# EAGLE design RM_htr (EAGLE 9.6.2)
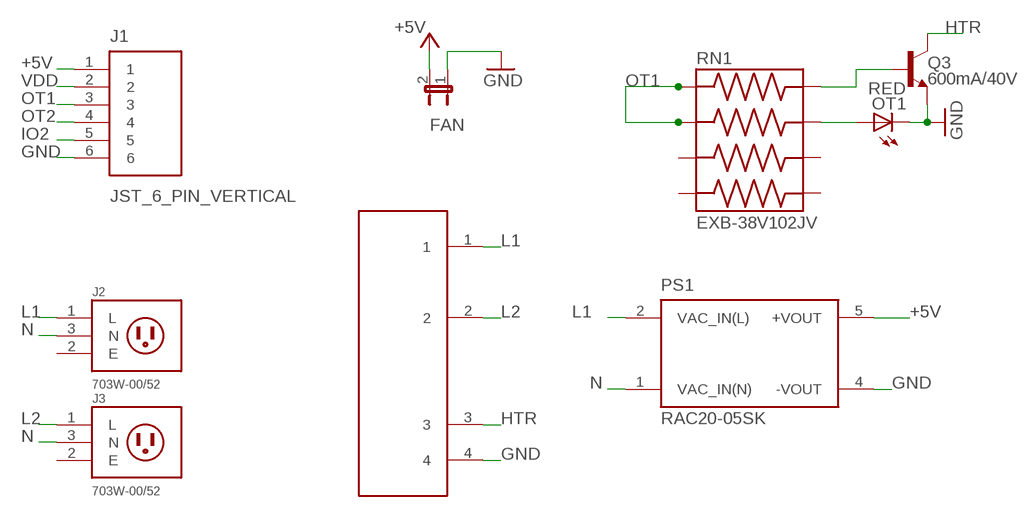
[diagram p0: schematic, sheet 1]

## Parts
FAN  JP1E  [JP1]
J1  JST_6_PIN_VERTICAL  [JST-6-SMD-VERT-1.0MM]
J2  703W-00/52  [QUALTEK_703W-00/52]
J3  703W-00/52  [QUALTEK_703W-00/52]
OT1  RED  LEDCHIPLED_0805  [CHIPLED_0805]
PS1  RAC20-05SK  [CONV_RAC20-05SK]
Q3  600mA/40V  TRANS_NPN-MMBT2222AL  [SOT23-3]
RN1  EXB-38V102JV  [RESCAXS80P320X160X60-8N]
U$1  PF240D25X  [PF240D25X]

## Nets
+5V: FAN.2 J1.1 PS1.5(+VOUT)
GND: FAN.1 J1.6 OT1.C PS1.4(-VOUT) Q3.2(E) U$1.4
HTR: Q3.3(C) U$1.3
IO2: J1.5
L1 [AC]: J2.1(L) PS1.2(VAC_IN(L)) U$1.1
L2 [AC]: J3.1(L) U$1.2
N [AC]: J2.3(N) J3.3(N) PS1.1(VAC_IN(N))
N$5: Q3.1(B) RN1.8
N$6: OT1.A RN1.7
OT1: J1.3 RN1.1 RN1.2
OT2: J1.4
VDD: J1.2
Unconnected: RN1.3 RN1.4 RN1.5 RN1.6

## Power pins joined to a net without a drawn wire
E: J2.2(E) J3.2(E)

## Library data of the parts
FAN = jumper:JP1E: JUMPER
J1 = SparkFun-Connectors:JST_6_PIN_VERTICAL: JST 6 pin vertical connector Here is a six pin vertical 1.0mm pitch connector. It is useful if you need something very tiny as a connection. These are not the standard JST type connectors we use on most of our boards, but are actually the much smaller JST-SH type. Here is the connector we sell at SparkFun: JST SH Vertical 6-Pin Connector - SMD <https://www.sparkfun.com/products/579> (GPS-00579) Datasheet <http://www.sparkfun.com/datasheets/GPS/EM406-SMDConnector-eSH.pdf> It was used on these SparkFun products: SparkFun GPS Breakout <https://www.sparkfun.com/products/11818> (BOB-11818) SparkFun Weather Shield <https://www.sparkfun.com/products/12081> (DEV-12081) And many, many other GPS related products.; PROD_ID: CONN-08249; SF_ID: GPS-00579
J2 J3 = 703W-00_52:703W-00/52: 3 Position 250 V 10 A Male Pins AC Receptacle Right Angle Connector; DESCRIPTION: Power Entry Connector Receptacle, Male Blades IEC 320-C14 Panel Mount, Flange; Through Hole, Right Angle; DIGI-KEY_PART_NUMBER: Q218-ND; MF: Qualtek; MP: 703W-00/52; PACKAGE: None
OT1 = adafruit:LED: LED OSRAM: - CHIPLED LG R971, LG N971, LY N971, LG Q971, LY Q971, LO R971, LY R971 LH N974, LH R974 LS Q976, LO Q976, LY Q976 LO Q996 - Hyper CHIPLED LW Q18S LB Q993, LB Q99A, LB R99A - SideLED LS A670, LO A670, LY A670, LG A670, LP A670 LB A673, LV A673, LT A673, LW A673 LH A674 LY A675 LS A676, LA A676, LO A676, LY A676, LW A676 LS A679, LY A679, LG A679 - Hyper Micro SIDELED® LS Y876, LA Y876, LO Y876, LY Y876 LT Y87S - SmartLED LW L88C, LW L88S LB L89C, LB L89S, LG L890 LS L89K, LO L89K, LY L89K LS L896, LA L896, LO L896, LY L896 - TOPLED LS T670, LO T670, LY T670, LG T670, LP T670 LSG T670, LSP T670, LSY T670, LOP T670, LYG T670 LG T671, LOG T671, LSG T671 LB T673, LV T673, LT T673, LW T673 LH T674 LS T676, LA T676, LO T676, LY T676, LB T676, LH T676, LSB T676, LW T676 LB T67C, LV T67C, LT T67C, LS T67K, LO T67K, LY T67K, LW E67C LS E67B, LA E67B, LO E67B, LY E67B, LB E67C, LV E67C, LT E67C LW T67C LS T679, LY T679, LG T679 LS T770, LO T770, LY T770, LG T770, LP T770 LB T773, LV T773, LT T773, LW T773 LH T774 LS E675, LA E675, LY E675, LS T675 LS T776, LA T776, LO T776, LY T776, LB T776 LHGB T686 LT T68C, LB T68C - Hyper Mini TOPLED® LB M676 - Mini TOPLED Santana® LG M470 LS M47K, LO M47K, LY M47K Source: http://www.osram.convergy.de/
PS1 = RAC20-05SK:RAC20-05SK: AC/DC CONVERTER 5V 20W; DESCRIPTION: 20W AC/DC-Converter 'POWERLINE' 2x1 3kV reg; DIGI-KEY_PART_NUMBER: 945-3184-ND; MF: Recom Power; MP: RAC20-05SK; PACKAGE: DIP-5 Recom Power; PURCHASE-URL: https://pricing.snapeda.com/search/part/RAC20-05SK/?ref=eda
Q3 = SparkFun-DiscreteSemi:TRANS_NPN: NPN transistor Current controlled devices typically used to amplify current or used as a switch. BC547 - COM-08928 <http://www.sparkfun.com/products/8928> (TO-92 45V 100mA) (1.Collector 2.Base 3.Emitter) 2N3904 - COM-00521 <http://www.sparkfun.com/products/521> (TO-92 40V 200mA) (1.Emitter 2.Base 3.Collector) P2N2222A - COM-12852 <http://www.sparkfun.com/products/12852> (TO-92 40V 600mA) (1.Collector 2.Base 3.Emitter); PROD_ID: TRANS-08049
RN1 = EXB-38V102JV:EXB-38V102JV: Res Thick Film Array 470 Ohm 5% ?200ppm/C ISOL Molded 8-Pin 1206(4 X 0603) Convex SMD Automotive T/R; DESCRIPTION: 1k Ohm ±5% 62.5mW Power Per Element Isolated Resistor Network/Array ±200ppm/°C 1206 (3216 Metric), Convex, Long Side Terminals; DIGI-KEY_PART_NUMBER: Y9102CT-ND; MF: Panasonic; MP: EXB-38V102JV; PACKAGE: 1206 Panasonic; PURCHASE-URL: https://pricing.snapeda.com/search/part/EXB-38V102JV/?ref=eda
U$1 = SSR:PF240D25X

## Net classes
0 default: width 0.305 mm, drill 0.127 mm, clearance 0.102 mm
1 DC: width 0.305 mm, drill 0.254 mm, clearance 0.102 mm to class 0, clearance 0.102 mm
2 AC: width 6.096 mm, drill 0.305 mm, clearance 0.406 mm to class 0, clearance 0.406 mm to class 1, clearance 0.406 mm
3 Hole: drill 2.05 mm, clearance 2.54 mm to class 0, clearance 2.54 mm to class 1, clearance 2.54 mm to class 2, clearance 5.08 mm

## Board
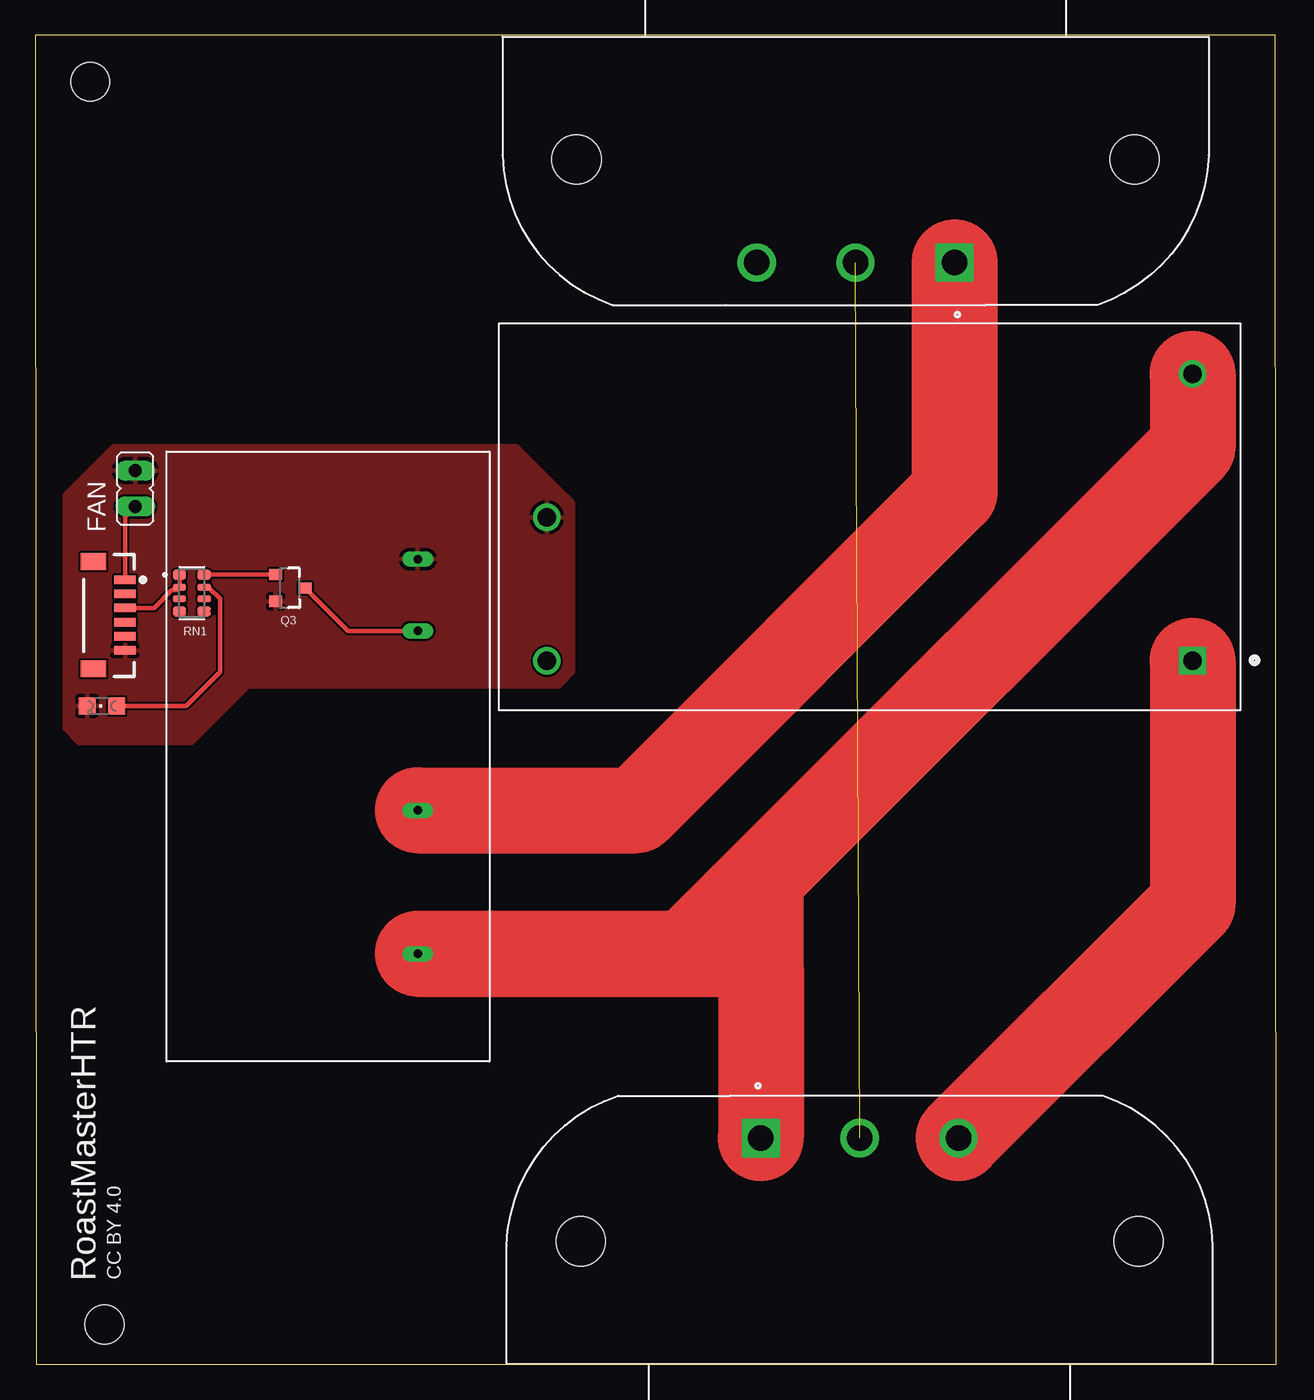
[diagram p1: board, top side]
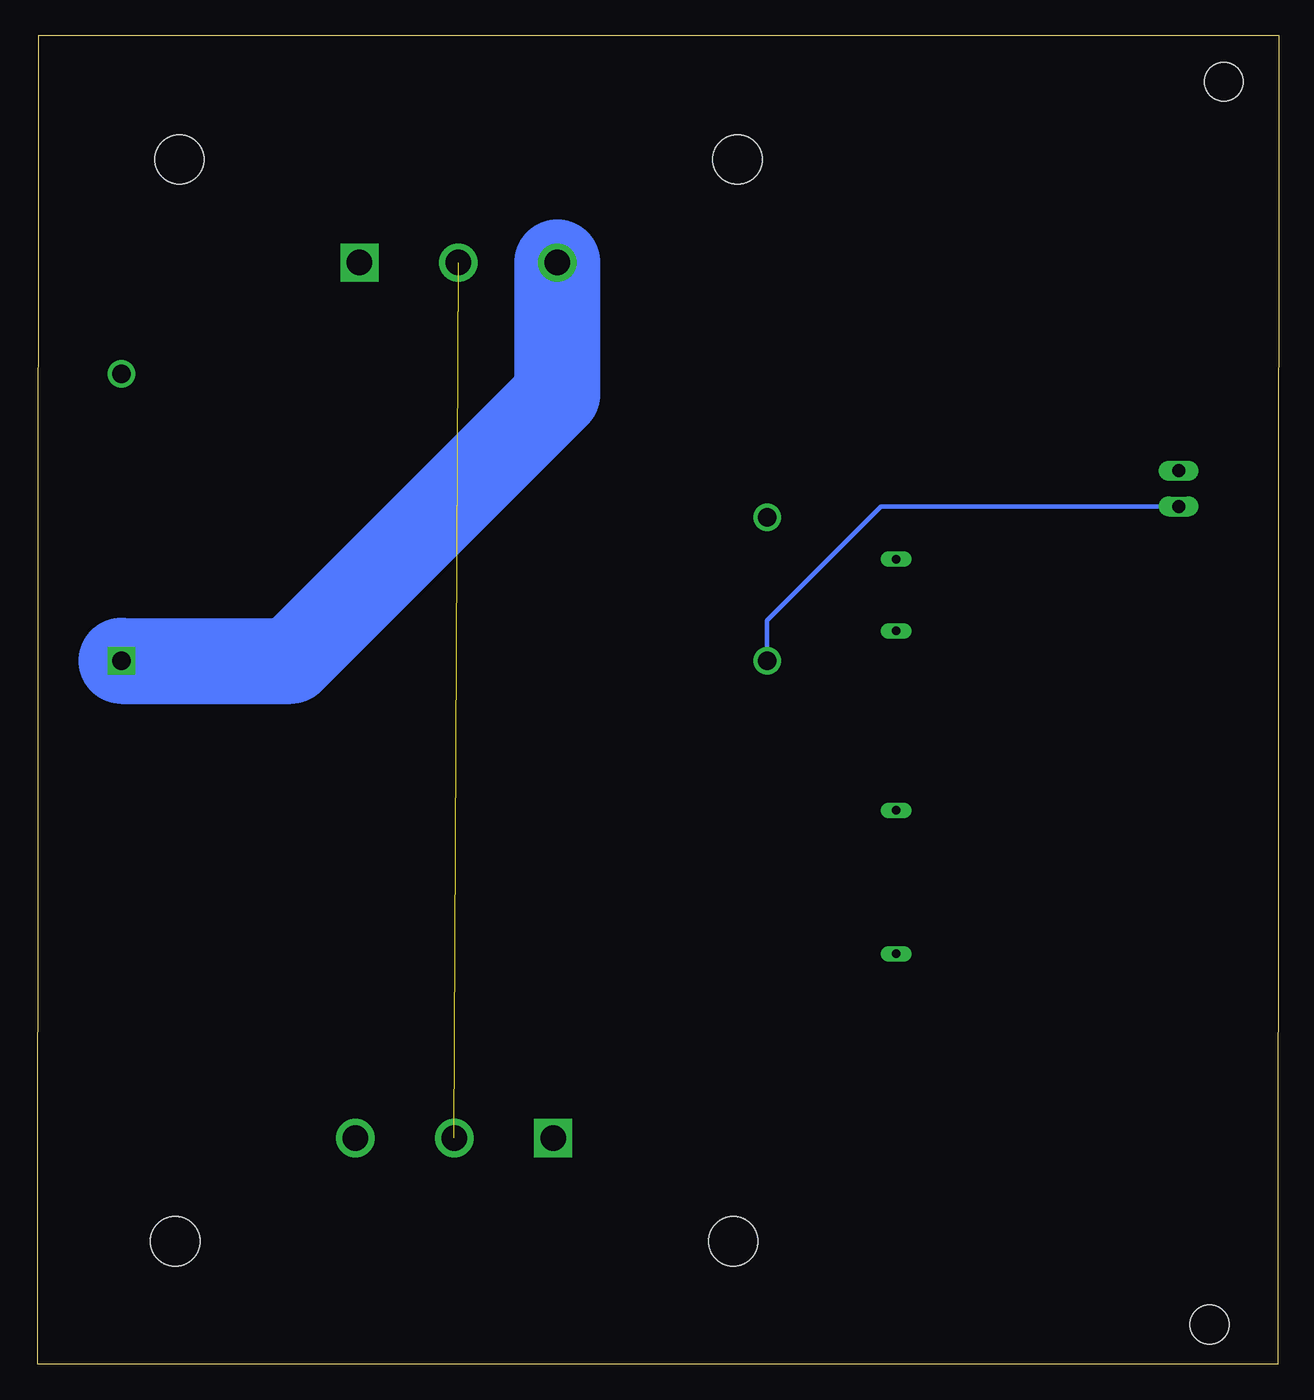
[diagram p2: board, bottom side, seen from below]

Size 87.88 x 94.09 mm. Coordinates in mm from the lower left corner, seen from the top.
Outline: 0.08,0 87.88,0 87.8,94.09 0,94.09 0.08,0
Copper layers (1*16): Top 0.035mm / dielectric 1.5mm / Bottom 0.035mm
Design rules "default": minimum track width 6mil, minimum drill 0.35mm, track to track 6mil, track to pad 6mil, pad to pad 6mil, via to via 6mil, smd to smd 6mil, copper to edge 40mil, drill to drill 6mil, minimum pad ring 10mil, minimum via ring 8mil, stop-mask expansion 4mil, vias tented up to drill 0mil, thermal gap 10mil
Holes 2.75 mm at 4.89,2.81 3.89,90.81

### Footprints (pad centres in the part's own frame; a part is rotated, then mirrored left to right if it is on the bottom)
JP1 = drill 0.914 long: 1 0,-1.27; 2 0,1.27
JST-6-SMD-VERT-1.0MM = smd 0.6 x 1.55: 1 -2.54,1.27; 2 -1.54,1.27; 3 -0.54,1.27; 4 0.46,1.27; 5 1.46,1.27; 6 2.46,1.27 | smd 1.2 x 1.8: P$1 -3.84,-0.955; P$2 3.76,-0.955
QUALTEK_703W-00/52 = drill 1.8 square: 1 0,0 | drill 1.8: 2 7,0; 3 14,0 | hole 3.5: 26.75,-7.3; -12.75,-7.3
CHIPLED_0805 = smd 1.2 x 1.2: A 0,-1.05; C 0,1.05
CONV_RAC20-05SK = drill 1.3 pad 1.95 square: 1 -22.86,10.2 | drill 1.3 pad 1.95: 2 -22.86,-10.12; 4 22.86,0.04; 5 22.86,10.2
SOT23-3 = smd 0.8 x 0.9: 1 -0.95,-1; 2 0.95,-1; 3 0,1.1
RESCAXS80P320X160X60-8N = smd 0.93 x 0.68: 1 -0.87,1.3; 4 -0.87,-1.3; 5 0.87,-1.3; 8 0.87,1.3 | smd 0.93 x 0.48: 2 -0.87,0.4; 3 -0.87,-0.4; 6 0.87,-0.4; 7 0.87,0.4
PF240D25X = drill 0.6 pad 1.016 long: 1 27.94,0; 2 17.78,0; 3 5.08,0; 4 0,0

### Placement (x,y rotation side)
FAN  7.08,62 180 top
J1  5.08,53 270 top
J2  51.37,16.01 0 top
J3  65.08,78 180 top
OT1  4.72,46.61 90 top
PS1  59.08,60 180 top
Q3  18.01,54.96 270 top
RN1  11.08,54.6 0 top
U$1  27.08,57 270 top

### Tracks (layer width: path | path; a pad name or v marks a point on that pad's centre or on a via)
+5V
  Top 0.305: FAN.2 6.35,60 J1.1
  Bottom 0.305: FAN.2 28.15,60.73 36.22,52.66 PS1.5
E  (1 unrouted)
GND
  pour Top: 2.08,61.53 2.08,45 3.08,44 11.08,44 15.08,48 37.08,48 38.08,49 38.08,61 34.08,65 5.55,65
HTR
  Top 0.305: Q3.3 22.15,51.92 U$1.3
L1
  Top 6.096: 51.37,28.1 51.37,34.38 | PS1.2 81.94,64.95 51.37,34.38 | 51.37,28.1 50.41,29.06 U$1.1 46.05,29.06 51.37,34.38 | 51.37,28.1 J2.1
L2
  Top 6.096: J3.1 65.08,61.74 42.56,39.22 U$1.2
N
  Top 6.096: J2.3 81.94,32.58 PS1.1
  Bottom 6.096: PS1.1 69.94,49.8 51.08,68.66 J3.3
N$5
  Top 0.305: RN1.8 Q3.1
N$6
  Top 0.305: RN1.7 12.29,55 13.08,54.21 13.08,49 10.69,46.61 OT1.A
OT1
  Top 0.305: J1.3 8.41,53.54 9.67,54.8 10.01,54.8 RN1.2 RN1.1

### Text on the board
tNames: RoastMasterHTR | CC BY 4.0